# Altium schematic sheet Lamps.SchDoc: {Наименование}
size 420 x 297 mm; ApprovedBy: {Утвердил}; CheckedBy: {Проверил}; DrawnBy: {Разработал}; Engineer: {Инженер}; DocumentNumber: {Обозначение}; SheetNumber: {}; SheetTotal: {}; Scale: {Масш.}; Title1str: {Наименование}; PageSetup: Record=PageOptions|CenterHorizontal=False|CenterVertical=False|PrintScale=0.95|XCorrection=0.00|YCorrection=0.00|PrintKind=1|BorderSize=5000000|LeftOffset=0|BottomOffset=0|Orientation=1|PaperLength=1000|PaperWidth=1000|Scale=100|PaperSource=15|PrintQuality=600|MediaType=1|DitherType=10|PaperKind=A4|PrintScaleMode=1; Title2str: {Наименование}; ProcessInspection: {Т.контр.}; Mass: {Масса}; NormInspection: {Н.контр.}; EngineerName: {Инженер}; Letter1Column: {}; Letter2Column: {}; Letter3Column: {}; DocumentType: {Документ}; DocumentType1str: {Документ}; DocumentType2str: {Документ}; ImagePath: {Перв. применение}; Rule: PcbType=ProtelPcb
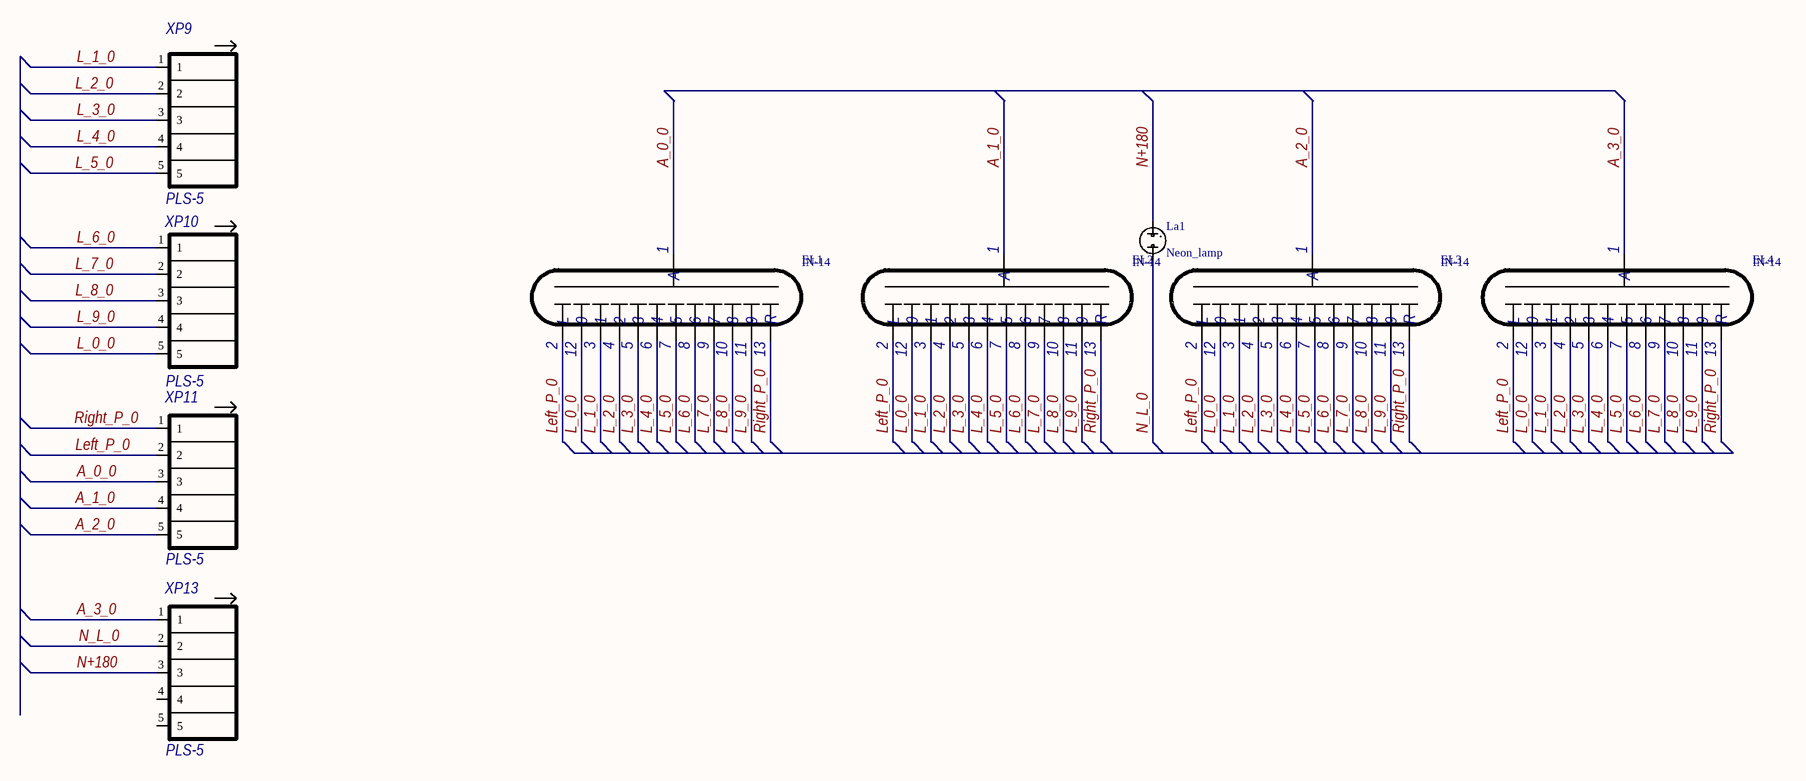
[diagram p0: Lamps.SchDoc]

## Parts
EL1  IN-14  [IN-14]
EL2  IN-14  [IN-14]
EL3  IN-14  [IN-14]
EL4  IN-14  [IN-14]
La1  Neon_lamp  [Neon_lamp]
XP9  PLS-5  [PLS-5]
XP10  PLS-5  [PLS-5]
XP11  PLS-5  [PLS-5]
XP13  PLS-5  [PLS-5]

## Nets
A_0_0: EL1.1(A) XP11.3
A_1_0: EL2.1(A) XP11.4
A_2_0: EL3.1(A) XP11.5
A_3_0: EL4.1(A) XP13.1
L_0_0: EL1.12(0) EL2.12(0) EL3.12(0) EL4.12(0) XP10.5
L_1_0: EL1.3(1) EL2.3(1) EL3.3(1) EL4.3(1) XP9.1
L_2_0: EL1.4(2) EL2.4(2) EL3.4(2) EL4.4(2) XP9.2
L_3_0: EL1.5(3) EL2.5(3) EL3.5(3) EL4.5(3) XP9.3
L_4_0: EL1.6(4) EL2.6(4) EL3.6(4) EL4.6(4) XP9.4
L_5_0: EL1.7(5) EL2.7(5) EL3.7(5) EL4.7(5) XP9.5
L_6_0: EL1.8(6) EL2.8(6) EL3.8(6) EL4.8(6) XP10.1
L_7_0: EL1.9(7) EL2.9(7) EL3.9(7) EL4.9(7) XP10.2
L_8_0: EL1.10(8) EL2.10(8) EL3.10(8) EL4.10(8) XP10.3
L_9_0: EL1.11(9) EL2.11(9) EL3.11(9) EL4.11(9) XP10.4
Left_P_0: EL1.2(L) EL2.2(L) EL3.2(L) EL4.2(L) XP11.2
N+180: La1.1(A) XP13.3
N_L_0: La1.2(C) XP13.2
Right_P_0: EL1.13(R) EL2.13(R) EL3.13(R) EL4.13(R) XP11.1

Not connected (* = marked no-connect by the designer): XP13 4 5

## Notes on the sheet
- Перв. примен.
- Справ. №
- Подп. и дата
- Инв. № дубл.
- Взам. инв. №
- Изм.
- Лист
- № докум.
- Подп.
- Дата
- Лит.
- Масса
- Масштаб
- Т.контр.
- Пров.
- Разраб.
- Листов
- Инв. № подл.
- Н.контр.
- Утв.
- Копировал
- Формат А3

## Library data of the parts
La1 = Neon_lamp: MP: 1N4148; MF: Nexperia USA Inc.; Availability: Unavailable; SnapEDA_Link: https://www.snapeda.com/parts/1N4148/Nexperia%20USA%20Inc./view-part/4413009/?ref=snap; Value: *; Package: DO-35 Nexperia USA Inc.; Price: None